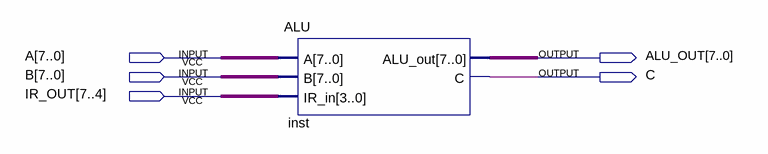
[diagram p0: schematic sheet]
// Quartus schematic MY_ALU.bdf as structural Verilog: 1 symbols, 5 pins
module MY_ALU (
  input  [7:0] A,
  input  [7:0] B,
  input  [7:4] IR_OUT,
  output [7:0] ALU_OUT,
  output C
);

  ALU inst (.A(A), .B(B), .IR_in(IR_OUT), .ALU_out(ALU_OUT), .C(C));
endmodule
